# EAGLE design Main (EAGLE 7.6.0)
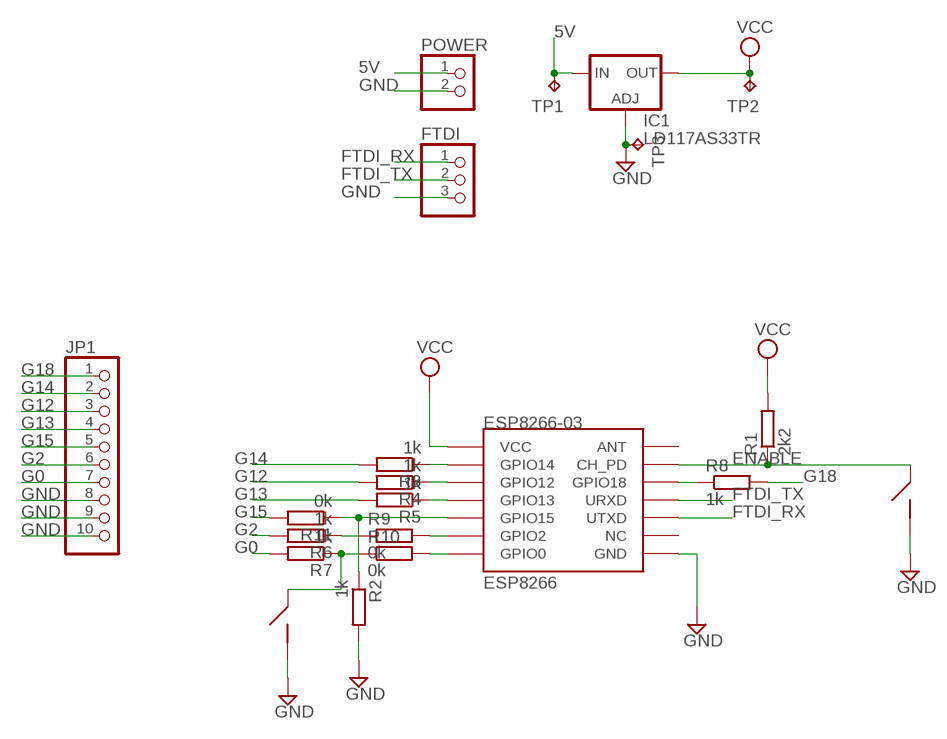
[diagram p0: schematic, sheet 1]

## Parts
ESP8266-03  ESP8266  [ESP03]
FTDI  PINHD-1X3  [1X03]
IC1  LD117AS33TR  [SOT223]
JP1  PINHD-1X10  [1X10]
POWER  PINHD-1X2  [1X02]
R1  2k2  R-EU_M0805  [M0805]
R2  1k  R-EU_M0805  [M0805]
R3  1k  R-EU_M0805  [M0805]
R4  1k  R-EU_M0805  [M0805]
R5  1k  R-EU_M0805  [M0805]
R6  1k  R-EU_M0805  [M0805]
R7  1k  R-EU_M0805  [M0805]
R8  1k  R-EU_M0805  [M0805]
R9  0k  R-EU_R1206  [R1206]
R10  0k  R-EU_R1206  [R1206]
R11  0k  R-EU_M0805  [M0805]
TP1  TPB1,27  [B1,27]
TP2  TPB1,27  [B1,27]
TP3  TPB1,27  [B1,27]
U$1  TACTILE  [DTSM31N]
U$2  TACTILE  [DTSM31N]

## Nets
5V: IC1.3(IN) POWER.1 TP1.TP
ENABLE: ESP8266-03.CH_PD R1.1 U$2.P$1
FTDI_RX: ESP8266-03.UTXD FTDI.1
FTDI_TX: ESP8266-03.URXD FTDI.2
G0: JP1.7 R7.2
G2: JP1.6 R6.2
G12: JP1.3 R4.2
G13: JP1.4 R5.2
G14: JP1.2 R3.2
G15: JP1.5 R11.2
G18: JP1.1 R8.2
GND: ESP8266-03.GND FTDI.3 IC1.1(ADJ) JP1.8 JP1.9 JP1.10 POWER.2 R2.2 TP3.TP U$1.P$2 U$2.P$2
N$1: ESP8266-03.GPIO15 R2.1 R11.1
N$3: ESP8266-03.GPIO2 R9.2
N$4: ESP8266-03.GPIO0 R10.2
N$5: ESP8266-03.GPIO18 R8.1
N$6: ESP8266-03.GPIO12 R4.1
N$7: ESP8266-03.GPIO13 R5.1
N$9: ESP8266-03.GPIO14 R3.1
N$22: R7.1 R10.1 U$1.P$1
N$24: R6.1 R9.1
VCC: ESP8266-03.VCC IC1.4(OUT) R1.2 TP2.TP
Unconnected: ESP8266-03.ANT ESP8266-03.NC

## Library data of the parts
ESP8266-03 = esp8266modules:ESP8266: ESP8266 Wifi module 03 & 04
FTDI = pinhead:PINHD-1X3: PIN HEADER
IC1 = v-reg:LD117A?*: Low drop fixed and adjustable positive voltage regulators 1 A Source: http://www.st.com/stonline/products/literature/ds/7194/ld1117axx.pdf
JP1 = pinhead:PINHD-1X10: PIN HEADER
POWER = pinhead:PINHD-1X2: PIN HEADER
R1-R11 = rcl:R-EU_: RESISTOR, European symbol
TP1-TP3 = testpad:TP: Test pad
U$1 U$2 = Communica:TACTILE

## Board
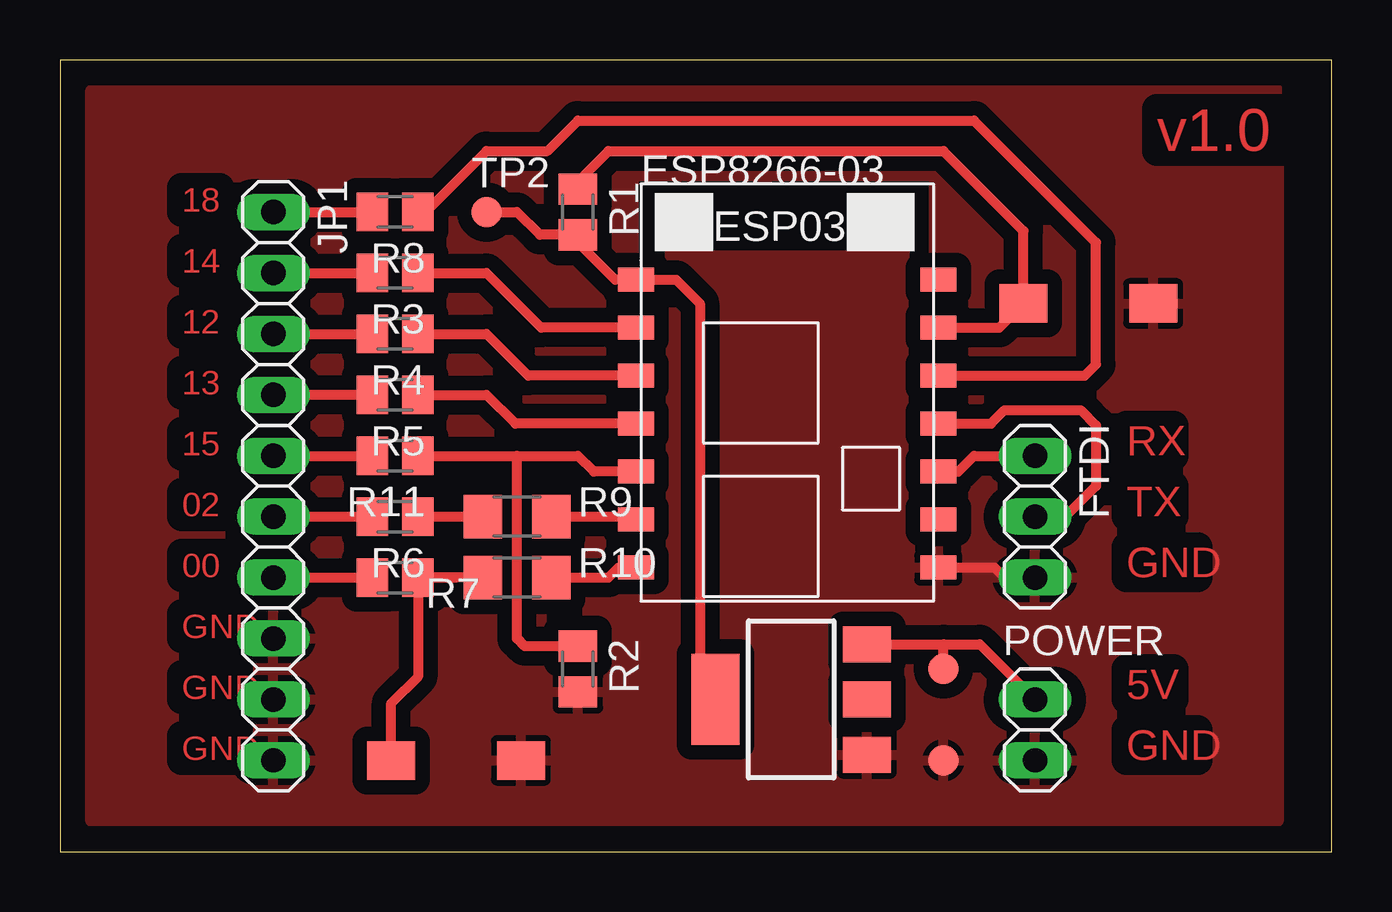
[diagram p1: board, top side]

Size 53.01 x 33.01 mm. Coordinates in mm from the lower left corner, seen from the top.
Outline: 0,0 53.01,0 53.01,33.01 0,33.01 0,0
Copper layers (1*16): Top 0.035mm / dielectric 1.5mm / Bottom 0.035mm
Design rules "default": minimum track width 10mil, minimum drill 24mil, track to track 8mil, track to pad 8mil, pad to pad 8mil, via to via 8mil, smd to smd 8mil, copper to edge 40mil, drill to drill 8mil, minimum pad ring 10mil, minimum via ring 8mil, stop-mask expansion 4mil, vias tented up to drill 0mil, thermal gap 10mil

### Footprints (pad centres in the part's own frame; a part is rotated, then mirrored left to right if it is on the bottom)
ESP03 = smd 1.5 x 1: ANT 7.4,4.8; CH_PD 7.4,2.8; GND 7.4,-7.2; GPIO0 -5.2,-7.2; GPIO2 -5.2,-5.2; GPIO12 -5.2,0.8; GPIO13 -5.2,-1.2; GPIO14 -5.2,2.8; GPIO15 -5.2,-3.2; GPIO18 7.4,0.8; NC 7.4,-5.2; URXD 7.4,-1.2; UTXD 7.4,-3.2; VCC -5.2,4.8
1X03 = drill 1.016 long: 1 -2.54,0; 2 0,0; 3 2.54,0
SOT223 = smd 1.5 x 2: 1 -2.3,-3.15; 2 0,-3.15; 3 2.3,-3.15 | smd 3.8 x 2: 4 0,3.15
1X10 = drill 1.016 long: 1 -11.43,0; 2 -8.89,0; 3 -6.35,0; 4 -3.81,0; 5 -1.27,0; 6 1.27,0; 7 3.81,0; 8 6.35,0; 9 8.89,0; 10 11.43,0
1X02 = drill 1.016 long: 1 -1.27,0; 2 1.27,0
M0805 = smd 1.3 x 1.6: 1 -0.95,0; 2 0.95,0
R1206 = smd 1.6 x 1.803: 1 -1.422,0; 2 1.422,0
B1,27 = smd 1.27 x 1.27: TP 0,0
DTSM31N = smd 2 x 1.6: P$1 -2.7,0; P$2 2.7,0

### Placement (x,y rotation side)
ESP8266-03  29.21,19.05 0 top
FTDI  40.64,13.97 270 top
IC1  30.48,6.35 90 top
JP1  8.89,15.24 270 top
POWER  40.64,5.08 270 top
R1  21.59,26.67 270 top
R2  21.59,7.62 270 top
R3  13.97,24.13 180 top
R4  13.97,21.59 180 top
R5  13.97,19.05 180 top
R6  13.97,13.97 180 top
R7  13.97,11.43 180 top
R8  13.97,26.67 180 top
R9  19.05,13.97 0 top
R10  19.05,11.43 0 top
R11  13.97,16.51 180 top
TP1  36.83,7.62 0 top
TP2  17.78,26.67 0 top
TP3  36.83,3.81 0 top
U$1  16.51,3.81 0 top
U$2  42.86,22.86 0 top

### Tracks (layer width: path | path; a pad name or v marks a point on that pad's centre or on a via)
5V
  Top 0.406: IC1.3 36.83,8.65 | 36.83,8.65 38.34,8.65 POWER.1 | TP1.TP 36.83,8.65
ENABLE
  Top 0.406: R1.1 21.59,27.94 22.86,29.21 36.83,29.21 40.16,25.88 U$2.P$1 39.15,21.85 ESP8266-03.CH_PD
FTDI_RX
  Top 0.406: ESP8266-03.UTXD 37.44,15.85 38.1,16.51 FTDI.1
FTDI_TX
  Top 0.406: ESP8266-03.URXD 38.8,17.85 39.37,18.42 42.55,18.42 43.18,17.78 43.18,15.24 41.91,13.97 FTDI.2
G0
  Top 0.406: JP1.7 R7.2
G2
  Top 0.406: JP1.6 R6.2
G12
  Top 0.406: JP1.3 R4.2
G13
  Top 0.406: R5.2 JP1.4
G14
  Top 0.406: JP1.2 R3.2
G15
  Top 0.406: JP1.5 R11.2
G18
  Top 0.406: JP1.1 R8.2
GND
  Top 0.406: ESP8266-03.GND 38.95,11.85 39.37,11.43 FTDI.3
  pour Top (isolate 0.61): 1.27,31.75 50.8,31.75 50.8,1.27 1.27,1.27
N$1
  Top 0.406: R11.1 19.05,16.51 | 19.05,16.51 21.59,16.51 22.25,15.85 ESP8266-03.GPIO15 | R2.1 19.37,8.57 19.05,8.89 19.05,16.51
N$2
  cutout Top: 24.13,27.94 36.2,27.94 36.2,25.08 24.13,25.08
N$3
  Top 0.406: R9.2 23.89,13.97 ESP8266-03.GPIO2
N$4
  Top 0.406: R10.2 22.86,11.43 23.28,11.85 ESP8266-03.GPIO0
N$5
  Top 0.406: R8.1 15.24,26.67 17.78,29.21 20.32,29.21 21.59,30.48 38.1,30.48 43.18,25.4 43.18,20.32 42.71,19.85 ESP8266-03.GPIO18
N$6
  Top 0.406: R4.1 17.78,21.59 19.52,19.85 ESP8266-03.GPIO12
N$7
  Top 0.406: ESP8266-03.GPIO13 18.98,17.85 17.78,19.05 R5.1
N$9
  Top 0.406: R3.1 17.78,24.13 20.06,21.85 ESP8266-03.GPIO14
N$22
  Top 0.406: R10.1 R7.1 | R7.1 16.51,11.43 | U$1.P$1 13.81,6.19 14.92,7.3 R7.1
N$24
  Top 0.406: R6.1 R9.1
VCC
  Top 0.406: IC1.4 26.67,7.01 26.67,22.86 25.68,23.85 ESP8266-03.VCC 23.14,23.85 21.59,25.4 R1.2 20,25.72 19.05,26.67 TP2.TP

### Text on the board
Top: v1.0 | 18 | 14 | 12 | 13 | 15 | RX | 02 | TX | 00 | GND | GND | GND | 5V | GND | GND